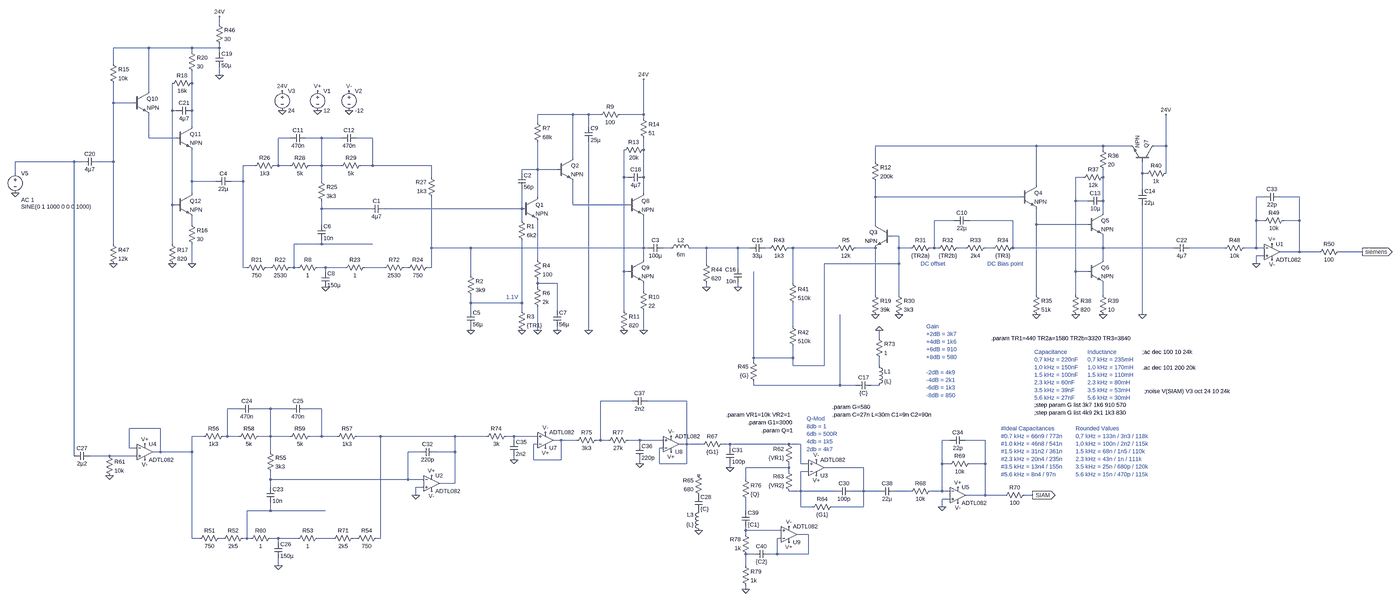
[diagram p0: schematic w295b.asc, whole sheet]
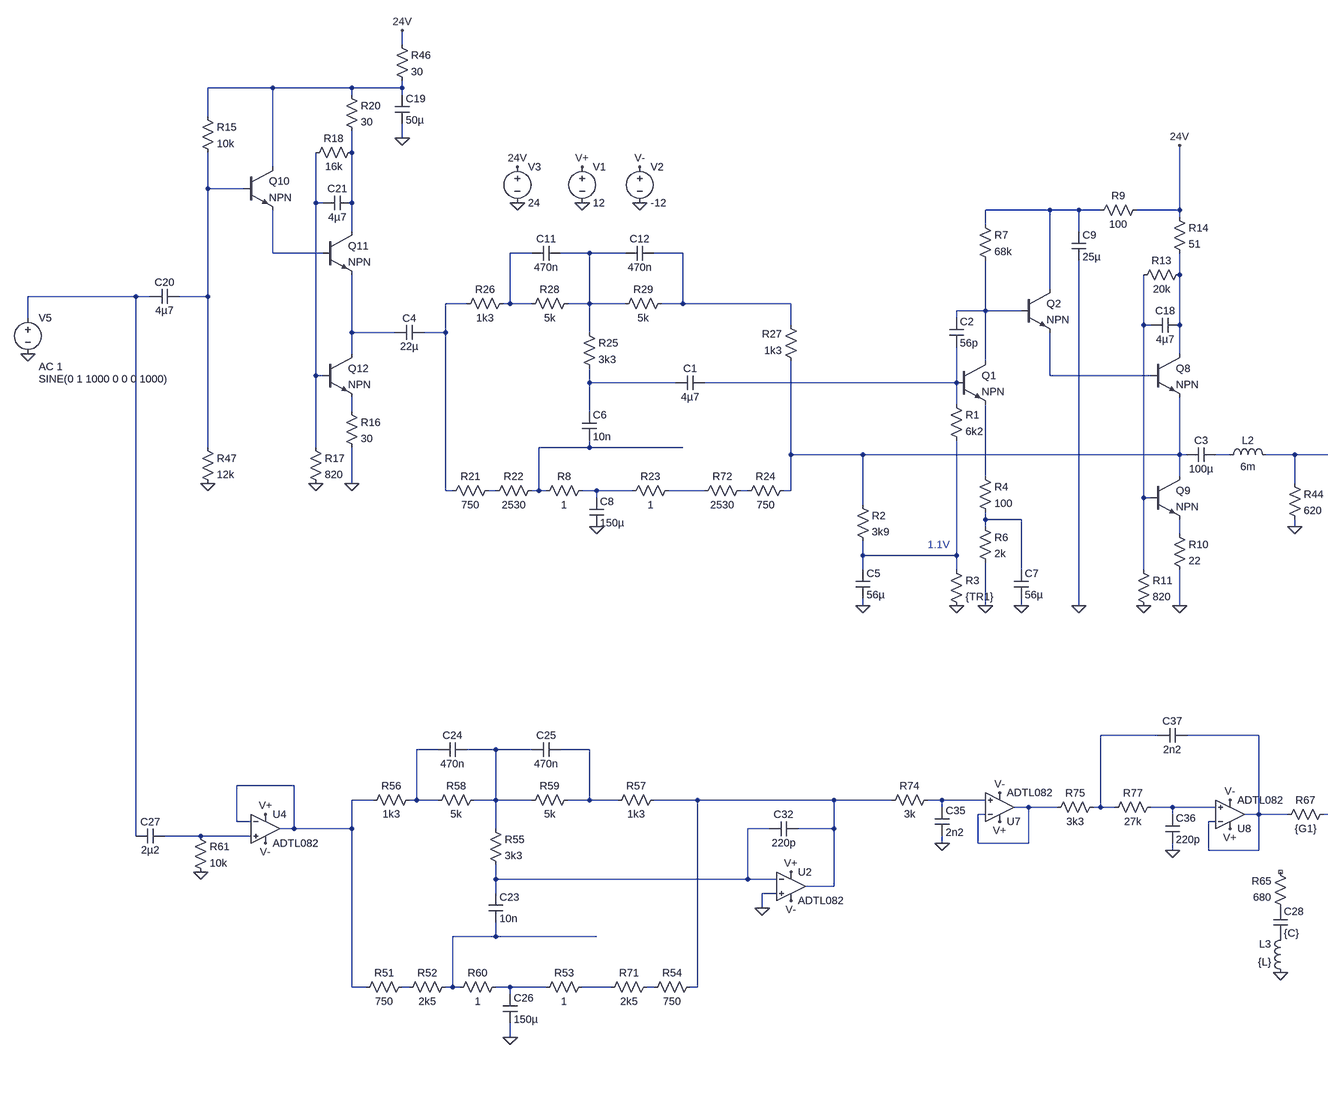
[diagram p1: schematic w295b.asc, part, row 1 of 1, column 1 of 2]
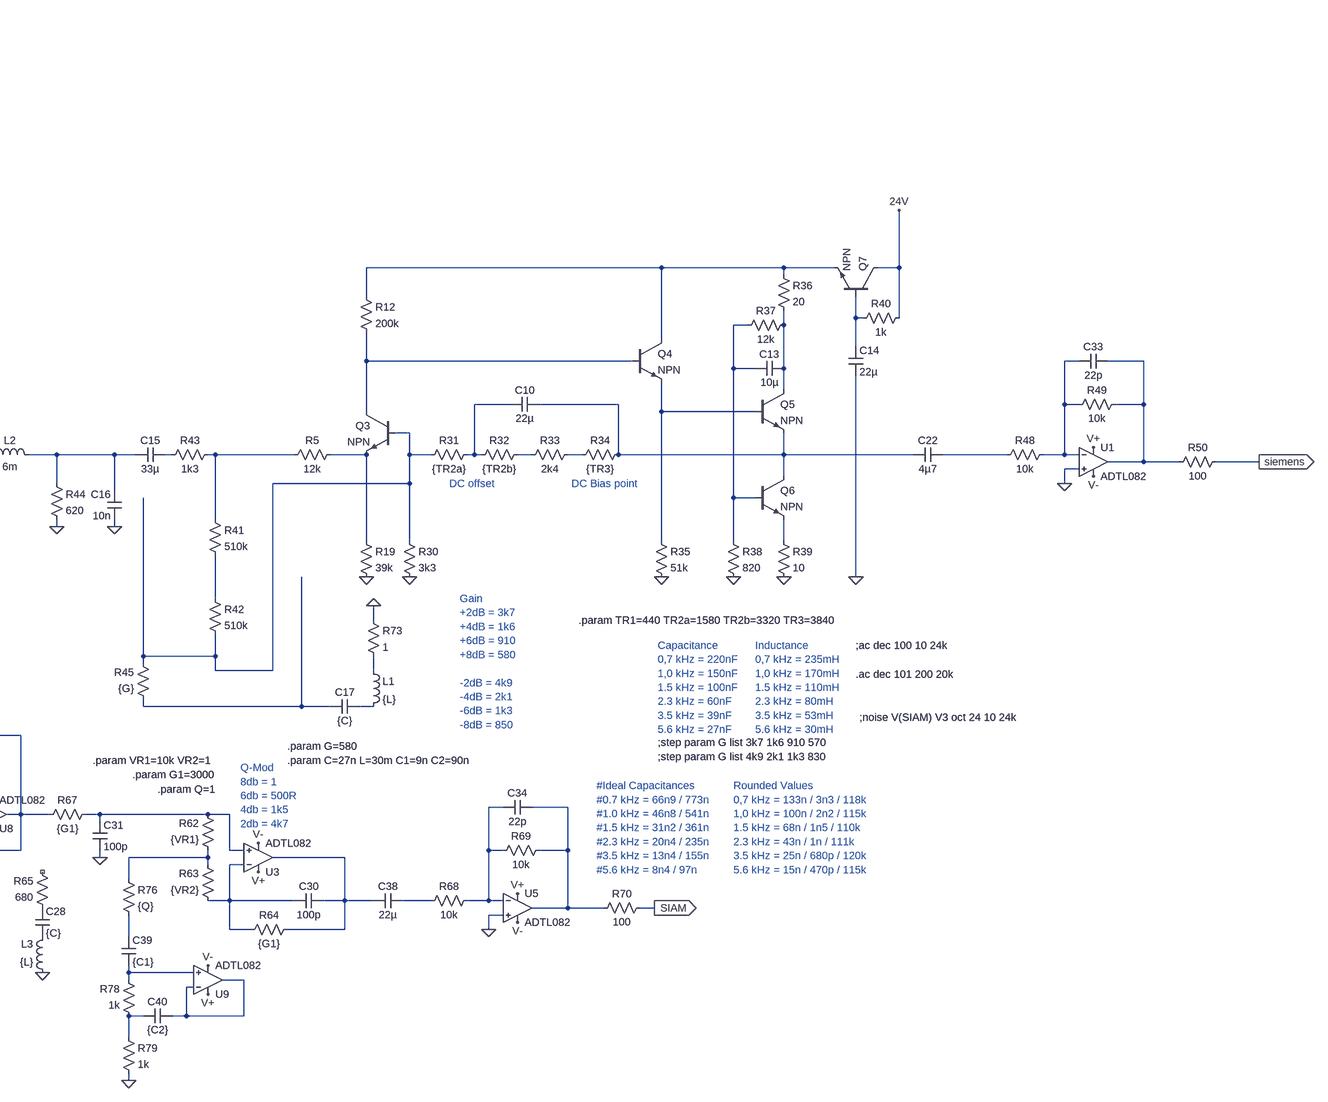
[diagram p2: schematic w295b.asc, part, row 1 of 1, column 2 of 2]
w295b.asc, the LTspice schematic file:
Version 4
SHEET 1 4260 2576
WIRE -1680 -944 -1680 -976
WIRE -1968 -848 -2112 -848
WIRE -1792 -848 -1968 -848
WIRE -1680 -848 -1680 -864
WIRE -1680 -848 -1792 -848
WIRE -1792 -832 -1792 -848
WIRE -1680 -832 -1680 -848
WIRE -2112 -784 -2112 -848
WIRE -1680 -736 -1680 -768
WIRE -1792 -704 -1792 -752
WIRE -1968 -672 -1968 -848
WIRE -2112 -624 -2112 -704
WIRE -2032 -624 -2112 -624
WIRE -1872 -592 -1872 -704
WIRE -1856 -592 -1872 -592
WIRE -1792 -592 -1792 -704
WIRE -240 -576 -384 -576
WIRE -176 -576 -240 -576
WIRE -128 -576 -176 -576
WIRE 48 -576 48 -720
WIRE 48 -576 -48 -576
WIRE 48 -560 48 -576
WIRE -384 -544 -384 -576
WIRE -1792 -528 -1792 -592
WIRE -176 -528 -176 -576
WIRE -1968 -480 -1968 -576
WIRE -1856 -480 -1968 -480
WIRE -1392 -480 -1440 -480
WIRE -1264 -480 -1328 -480
WIRE -1184 -480 -1264 -480
WIRE -1056 -480 -1120 -480
WIRE 1648 -448 992 -448
WIRE 1920 -448 1648 -448
WIRE 2032 -448 1920 -448
WIRE 2176 -448 2176 -576
WIRE 2176 -448 2128 -448
WIRE 48 -432 48 -480
WIRE 1920 -432 1920 -448
WIRE -240 -400 -240 -576
WIRE -2272 -384 -2512 -384
WIRE -2240 -384 -2272 -384
WIRE -2112 -384 -2112 -624
WIRE -2112 -384 -2176 -384
WIRE 992 -384 992 -448
WIRE -1536 -368 -1584 -368
WIRE -1440 -368 -1440 -480
WIRE -1440 -368 -1456 -368
WIRE -1392 -368 -1440 -368
WIRE -1264 -368 -1264 -480
WIRE -1264 -368 -1312 -368
WIRE -1184 -368 -1264 -368
WIRE -1056 -368 -1056 -480
WIRE -1056 -368 -1104 -368
WIRE -816 -368 -1056 -368
WIRE -384 -352 -384 -464
WIRE -384 -352 -448 -352
WIRE -304 -352 -384 -352
WIRE -2512 -336 -2512 -384
WIRE -448 -336 -448 -352
WIRE 2080 -336 2080 -384
WIRE 2096 -336 2080 -336
WIRE 2176 -336 2176 -448
WIRE -816 -320 -816 -368
WIRE -32 -320 -32 -432
WIRE -16 -320 -32 -320
WIRE 48 -320 48 -432
WIRE 1840 -320 1808 -320
WIRE 1920 -320 1920 -352
WIRE -1792 -304 -1792 -432
WIRE -1696 -304 -1792 -304
WIRE -1584 -304 -1584 -368
WIRE -1584 -304 -1632 -304
WIRE -1264 -304 -1264 -368
WIRE 1648 -288 1648 -448
WIRE 2080 -272 2080 -336
WIRE -1792 -256 -1792 -304
WIRE 48 -256 48 -320
WIRE -384 -240 -384 -352
WIRE 992 -240 992 -304
WIRE 1584 -240 992 -240
WIRE 2576 -240 2544 -240
WIRE 2720 -240 2640 -240
WIRE 1808 -224 1808 -320
WIRE 1856 -224 1808 -224
WIRE 1920 -224 1920 -320
WIRE -1872 -208 -1872 -592
WIRE -1856 -208 -1872 -208
WIRE -240 -208 -240 -304
WIRE -16 -208 -240 -208
WIRE -1264 -192 -1264 -224
WIRE -1072 -192 -1264 -192
WIRE -448 -192 -448 -272
WIRE -448 -192 -1008 -192
WIRE 1920 -176 1920 -224
WIRE -448 -144 -448 -192
WIRE 1312 -144 1232 -144
WIRE 1552 -144 1376 -144
WIRE 2544 -144 2544 -240
WIRE 2576 -144 2544 -144
WIRE 2720 -144 2720 -240
WIRE 2720 -144 2656 -144
WIRE -1792 -128 -1792 -160
WIRE -1264 -128 -1264 -192
WIRE 992 -128 992 -240
WIRE 1648 -128 1648 -192
WIRE 1856 -128 1648 -128
WIRE 1088 -80 1056 -80
WIRE -2112 -48 -2112 -384
WIRE -1872 -48 -1872 -208
WIRE -1264 -48 -1264 -64
WIRE -1264 -48 -1376 -48
WIRE -1056 -48 -1264 -48
WIRE -816 -32 -816 -240
WIRE -656 -32 -816 -32
WIRE 48 -32 48 -160
WIRE 48 -32 -656 -32
WIRE 64 -32 48 -32
WIRE 160 -32 128 -32
WIRE 304 -32 240 -32
WIRE 432 -32 304 -32
WIRE 480 -32 432 -32
WIRE 560 -32 544 -32
WIRE 656 -32 640 -32
WIRE 832 -32 656 -32
WIRE 992 -32 912 -32
WIRE 1088 -32 1088 -80
WIRE 1136 -32 1088 -32
WIRE 1232 -32 1232 -144
WIRE 1232 -32 1216 -32
WIRE 1248 -32 1232 -32
WIRE 1360 -32 1328 -32
WIRE 1472 -32 1440 -32
WIRE 1552 -32 1552 -144
WIRE 1920 -32 1920 -80
WIRE 1920 -32 1552 -32
WIRE 2208 -32 1920 -32
WIRE 2416 -32 2272 -32
WIRE 2544 -32 2544 -144
WIRE 2544 -32 2496 -32
WIRE 2576 -32 2544 -32
WIRE 2720 -16 2720 -144
WIRE 2720 -16 2640 -16
WIRE 2800 -16 2720 -16
WIRE 2976 -16 2880 -16
WIRE 2576 0 2544 0
WIRE -384 16 -384 -144
WIRE 48 16 48 -32
WIRE 1920 16 1920 -32
WIRE -1792 32 -1792 -48
WIRE 304 32 304 -32
WIRE 1088 32 1088 -32
WIRE 1088 32 784 32
WIRE 2544 32 2544 0
WIRE -1584 48 -1584 -304
WIRE -1568 48 -1584 48
WIRE -1472 48 -1488 48
WIRE -1376 48 -1376 -48
WIRE -1376 48 -1392 48
WIRE -1360 48 -1376 48
WIRE -1248 48 -1280 48
WIRE -1168 48 -1248 48
WIRE -1008 48 -1088 48
WIRE -912 48 -928 48
WIRE -816 48 -816 -32
WIRE -816 48 -832 48
WIRE 432 48 432 -32
WIRE -1248 64 -1248 48
WIRE -32 64 -32 -320
WIRE -16 64 -32 64
WIRE 1808 64 1808 -224
WIRE 1856 64 1808 64
WIRE -656 80 -656 -32
WIRE -384 112 -384 96
WIRE -304 112 -384 112
WIRE 656 112 656 -32
WIRE -384 128 -384 112
WIRE 304 128 304 112
WIRE 432 128 432 112
WIRE 48 144 48 112
WIRE 992 160 992 -32
WIRE 1088 160 1088 32
WIRE 1648 160 1648 -128
WIRE 1808 160 1808 64
WIRE 1920 160 1920 112
WIRE -656 192 -656 160
WIRE -448 192 -448 -64
WIRE -448 192 -656 192
WIRE -656 224 -656 192
WIRE -448 224 -448 192
WIRE -304 224 -304 112
WIRE -32 224 -32 64
WIRE 2080 240 2080 -208
WIRE 656 288 656 192
WIRE -656 304 -656 288
WIRE -384 304 -384 208
WIRE -304 304 -304 288
WIRE -176 304 -176 -464
WIRE 48 304 48 224
WIRE 1008 336 1008 304
WIRE 496 416 496 64
WIRE 656 416 656 368
WIRE 656 416 496 416
WIRE 496 432 496 416
WIRE 656 448 656 416
WIRE 784 448 784 32
WIRE 784 448 656 448
WIRE 1008 448 1008 416
WIRE 496 528 496 512
WIRE 848 528 848 240
WIRE 848 528 496 528
WIRE 912 528 848 528
WIRE 1008 528 976 528
WIRE 0 592 -128 592
WIRE 224 592 64 592
WIRE -1600 624 -1648 624
WIRE -1472 624 -1536 624
WIRE -1392 624 -1472 624
WIRE -1264 624 -1328 624
WIRE -1920 704 -2048 704
WIRE -1744 736 -1792 736
WIRE -1648 736 -1648 624
WIRE -1648 736 -1664 736
WIRE -1600 736 -1648 736
WIRE -1472 736 -1472 624
WIRE -1472 736 -1520 736
WIRE -1392 736 -1472 736
WIRE -1264 736 -1264 624
WIRE -1264 736 -1312 736
WIRE -1200 736 -1264 736
WIRE -1024 736 -1120 736
WIRE -720 736 -1024 736
WIRE -592 736 -720 736
WIRE -480 736 -512 736
WIRE -384 736 -480 736
WIRE -480 752 -480 736
WIRE -288 752 -320 752
WIRE -224 752 -288 752
WIRE -128 752 -128 592
WIRE -128 752 -144 752
WIRE -96 752 -128 752
WIRE 32 752 -16 752
WIRE 128 752 32 752
WIRE 1296 752 1264 752
WIRE 1440 752 1360 752
WIRE -384 768 -400 768
WIRE 32 768 32 752
WIRE 224 768 224 592
WIRE 224 768 192 768
WIRE 288 768 224 768
WIRE 400 768 368 768
WIRE 640 768 400 768
WIRE 688 768 640 768
WIRE -2048 784 -2048 704
WIRE -2016 784 -2048 784
WIRE 128 784 112 784
WIRE 400 784 400 768
WIRE -1920 800 -1920 704
WIRE -1920 800 -1952 800
WIRE -1792 800 -1792 736
WIRE -1792 800 -1920 800
WIRE -1472 800 -1472 736
WIRE -864 800 -912 800
WIRE -720 800 -720 736
WIRE -720 800 -800 800
WIRE -2272 816 -2272 -384
WIRE -2128 816 -2208 816
WIRE -2016 816 -2128 816
WIRE -480 832 -480 816
WIRE -400 832 -400 768
WIRE -288 832 -288 752
WIRE -288 832 -400 832
WIRE 32 848 32 832
WIRE 112 848 112 784
WIRE 224 848 224 768
WIRE 224 848 112 848
WIRE 688 848 688 768
WIRE 720 848 688 848
WIRE 1264 848 1264 752
WIRE 1296 848 1264 848
WIRE 1440 848 1440 752
WIRE 1440 848 1376 848
WIRE 400 864 400 848
WIRE 640 864 640 848
WIRE 640 864 464 864
WIRE 944 864 784 864
WIRE 640 880 640 864
WIRE 720 880 688 880
WIRE -1472 912 -1472 880
WIRE -912 912 -912 800
WIRE -912 912 -1472 912
WIRE -848 912 -912 912
WIRE 464 912 464 864
WIRE -720 928 -720 800
WIRE -720 928 -784 928
WIRE -1472 944 -1472 912
WIRE -848 944 -880 944
WIRE 688 960 688 880
WIRE 688 960 640 960
WIRE 832 960 688 960
WIRE 944 960 944 864
WIRE 944 960 896 960
WIRE 1008 960 944 960
WIRE 1136 960 1072 960
WIRE 1264 960 1264 848
WIRE 1264 960 1216 960
WIRE 1296 960 1264 960
WIRE -880 976 -880 944
WIRE 1440 976 1440 848
WIRE 1440 976 1360 976
WIRE 1520 976 1440 976
WIRE 1632 976 1600 976
WIRE 1296 992 1264 992
WIRE 688 1024 688 960
WIRE 736 1024 688 1024
WIRE 944 1024 944 960
WIRE 944 1024 816 1024
WIRE 1264 1024 1264 992
WIRE -1472 1040 -1472 1008
WIRE -1472 1040 -1568 1040
WIRE -1248 1040 -1472 1040
WIRE 464 1040 464 992
WIRE 464 1120 464 1104
WIRE 608 1120 464 1120
WIRE 464 1136 464 1120
WIRE 720 1136 672 1136
WIRE -1792 1152 -1792 800
WIRE -1760 1152 -1792 1152
WIRE -1664 1152 -1680 1152
WIRE -1568 1152 -1568 1040
WIRE -1568 1152 -1584 1152
WIRE -1552 1152 -1568 1152
WIRE -1440 1152 -1472 1152
WIRE -1360 1152 -1440 1152
WIRE -1216 1152 -1280 1152
WIRE -1120 1152 -1136 1152
WIRE -1024 1152 -1024 736
WIRE -1024 1152 -1040 1152
WIRE 608 1152 592 1152
WIRE -1440 1168 -1440 1152
WIRE 496 1216 464 1216
WIRE 592 1216 592 1152
WIRE 592 1216 560 1216
WIRE 720 1216 720 1136
WIRE 720 1216 592 1216
WIRE -1440 1264 -1440 1232
WIRE 464 1264 464 1216
WIRE 464 1360 464 1344
FLAG -1280 -592 0
FLAG -1280 -672 V+
FLAG -1152 -592 0
FLAG -1152 -672 V-
FLAG -2512 -256 0
FLAG -1248 128 0
FLAG -1424 -592 0
FLAG -1424 -672 24V
FLAG 992 240 0
FLAG 1088 240 0
FLAG 1648 240 0
FLAG 2976 -16 siemens
IOPIN 2976 -16 Out
FLAG 1808 240 0
FLAG 1920 240 0
FLAG 2176 -576 24V
FLAG 2080 240 0
FLAG 304 128 0
FLAG 432 128 0
FLAG 1008 304 0
FLAG -448 304 0
FLAG -656 304 0
FLAG -384 304 0
FLAG -304 304 0
FLAG -176 304 0
FLAG -32 304 0
FLAG 48 304 0
FLAG 48 -720 24V
FLAG -1872 32 0
FLAG -1792 32 0
FLAG -1680 -976 24V
FLAG -1680 -736 0
FLAG -2112 32 0
FLAG 2544 32 0
FLAG 2608 -48 V+
FLAG 2608 16 V-
FLAG -1440 1264 0
FLAG -816 896 V+
FLAG -816 960 V-
FLAG -880 976 0
FLAG 1632 976 SIAM
IOPIN 1632 976 Out
FLAG -1984 768 V+
FLAG -1984 832 V-
FLAG -2128 896 0
FLAG 752 896 V+
FLAG 752 832 V-
FLAG 400 864 0
FLAG 1264 1024 0
FLAG 1328 944 V+
FLAG 1328 1008 V-
FLAG -352 784 V+
FLAG -352 720 V-
FLAG 160 800 V+
FLAG 160 736 V-
FLAG -480 832 0
FLAG 32 848 0
FLAG 640 1168 V+
FLAG 640 1104 V-
FLAG 464 1360 0
FLAG 272 1120 0
SYMBOL voltage -1280 -688 R0
WINDOW 123 0 0 Left 0
WINDOW 39 0 0 Left 0
SYMATTR InstName V1
SYMATTR Value 12
SYMBOL voltage -1152 -688 R0
WINDOW 123 0 0 Left 0
WINDOW 39 0 0 Left 0
SYMATTR InstName V2
SYMATTR Value -12
SYMBOL res -1472 32 R90
WINDOW 0 0 56 VBottom 2
WINDOW 3 32 56 VTop 2
SYMATTR InstName R21
SYMATTR Value 750
SYMBOL res -1376 32 R90
WINDOW 0 0 56 VBottom 2
WINDOW 3 32 56 VTop 2
SYMATTR InstName R22
SYMATTR Value 2530
SYMBOL res -1072 32 R90
WINDOW 0 0 56 VBottom 2
WINDOW 3 32 56 VTop 2
SYMATTR InstName R23
SYMATTR Value 1
SYMBOL res -816 32 R90
WINDOW 0 0 56 VBottom 2
WINDOW 3 32 56 VTop 2
SYMATTR InstName R24
SYMATTR Value 750
SYMBOL cap -1280 -128 R0
SYMATTR InstName C6
SYMATTR Value 10n
SYMBOL res -1280 -320 R0
SYMATTR InstName R25
SYMATTR Value 3k3
SYMBOL res -1440 -384 R90
WINDOW 0 0 56 VBottom 2
WINDOW 3 32 56 VTop 2
SYMATTR InstName R26
SYMATTR Value 1k3
SYMBOL res -800 -224 R180
WINDOW 0 36 76 Left 2
WINDOW 3 36 40 Left 2
SYMATTR InstName R27
SYMATTR Value 1k3
SYMBOL cap -1328 -496 R90
WINDOW 0 0 32 VBottom 2
WINDOW 3 32 32 VTop 2
SYMATTR InstName C11
SYMATTR Value 470n
SYMBOL cap -1120 -496 R90
WINDOW 0 0 32 VBottom 2
WINDOW 3 32 32 VTop 2
SYMATTR InstName C12
SYMATTR Value 470n
SYMBOL res -1296 -384 R90
WINDOW 0 0 56 VBottom 2
WINDOW 3 32 56 VTop 2
SYMATTR InstName R28
SYMATTR Value 5k
SYMBOL res -1088 -384 R90
WINDOW 0 0 56 VBottom 2
WINDOW 3 32 56 VTop 2
SYMATTR InstName R29
SYMATTR Value 5k
SYMBOL voltage -2512 -352 R0
WINDOW 3 24 152 Left 2
WINDOW 123 24 124 Left 2
WINDOW 39 0 0 Left 0
SYMATTR Value SINE(0 1 1000 0 0 0 1000)
SYMATTR Value2 AC 1
SYMATTR InstName V5
SYMBOL res -1264 32 R90
WINDOW 0 0 56 VBottom 2
WINDOW 3 32 56 VTop 2
SYMATTR InstName R8
SYMATTR Value 1
SYMBOL cap -1264 64 R0
SYMATTR InstName C8
SYMATTR Value 150µ
SYMBOL cap -1696 -320 M90
WINDOW 0 0 32 VBottom 2
WINDOW 3 32 32 VTop 2
SYMATTR InstName C4
SYMATTR Value 22µ
SYMBOL voltage -1424 -688 R0
WINDOW 123 0 0 Left 0
WINDOW 39 0 0 Left 0
SYMATTR InstName V3
SYMATTR Value 24
SYMBOL npn 1056 -128 M0
SYMATTR InstName Q3
SYMBOL npn 2128 -384 M270
SYMATTR InstName Q7
SYMBOL res 928 -48 R90
WINDOW 0 0 56 VBottom 2
WINDOW 3 32 56 VTop 2
SYMATTR InstName R5
SYMATTR Value 12k
SYMBOL res 976 -400 R0
SYMATTR InstName R12
SYMATTR Value 200k
SYMBOL res 976 144 R0
SYMATTR InstName R19
SYMATTR Value 39k
SYMBOL res 1072 144 R0
SYMATTR InstName R30
SYMATTR Value 3k3
SYMBOL res 1232 -48 R90
WINDOW 0 0 56 VBottom 2
WINDOW 3 32 56 VTop 2
SYMATTR InstName R31
SYMATTR Value {TR2a}
SYMBOL res 1344 -48 R90
WINDOW 0 0 56 VBottom 2
WINDOW 3 32 56 VTop 2
SYMATTR InstName R32
SYMATTR Value {TR2b}
SYMBOL res 1456 -48 R90
WINDOW 0 0 56 VBottom 2
WINDOW 3 32 56 VTop 2
SYMATTR InstName R33
SYMATTR Value 2k4
SYMBOL res 1568 -48 R90
WINDOW 0 0 56 VBottom 2
WINDOW 3 32 56 VTop 2
SYMATTR InstName R34
SYMATTR Value {TR3}
SYMBOL cap 1376 -160 R90
WINDOW 0 0 32 VBottom 2
WINDOW 3 32 32 VTop 2
SYMATTR InstName C10
SYMATTR Value 22µ
SYMBOL npn 1584 -288 R0
SYMATTR InstName Q4
SYMBOL npn 1856 -176 R0
SYMATTR InstName Q5
SYMBOL npn 1856 16 R0
SYMATTR InstName Q6
SYMBOL res 1632 144 R0
SYMATTR InstName R35
SYMATTR Value 51k
SYMBOL res 1904 -448 R0
SYMATTR InstName R36
SYMATTR Value 20
SYMBOL res 1936 -336 R90
WINDOW 0 0 56 VBottom 2
WINDOW 3 32 56 VTop 2
SYMATTR InstName R37
SYMATTR Value 12k
SYMBOL cap 1920 -240 R90
WINDOW 0 0 32 VBottom 2
WINDOW 3 32 32 VTop 2
SYMATTR InstName C13
SYMATTR Value 10µ
SYMBOL res 1792 144 R0
SYMATTR InstName R38
SYMATTR Value 820
SYMBOL res 1904 144 R0
SYMATTR InstName R39
SYMATTR Value 10
SYMBOL res 2192 -352 R90
WINDOW 0 0 56 VBottom 2
WINDOW 3 32 56 VTop 2
SYMATTR InstName R40
SYMATTR Value 1k
SYMBOL cap 2064 -272 R0
SYMATTR InstName C14
SYMATTR Value 22µ
SYMBOL res 640 96 R0
SYMATTR InstName R41
SYMATTR Value 510k
SYMBOL res 640 272 R0
SYMATTR InstName R42
SYMATTR Value 510k
SYMBOL res 656 -48 R90
WINDOW 0 0 56 VBottom 2
WINDOW 3 32 56 VTop 2
SYMATTR InstName R43
SYMATTR Value 1k3
SYMBOL cap 544 -48 R90
WINDOW 0 0 32 VBottom 2
WINDOW 3 32 32 VTop 2
SYMATTR InstName C15
SYMATTR Value 33µ
SYMBOL cap 448 112 R180
WINDOW 0 24 56 Left 2
WINDOW 3 24 8 Left 2
SYMATTR InstName C16
SYMATTR Value 10n
SYMBOL res 288 16 R0
SYMATTR InstName R44
SYMATTR Value 620
SYMBOL res 512 528 R180
WINDOW 0 36 76 Left 2
WINDOW 3 36 40 Left 2
SYMATTR InstName R45
SYMATTR Value {G}
SYMBOL cap 976 512 R90
WINDOW 0 0 32 VBottom 2
WINDOW 3 32 32 VTop 2
SYMATTR InstName C17
SYMATTR Value {C}
SYMBOL ind 992 432 R0
SYMATTR InstName L1
SYMATTR Value {L}
SYMBOL cap 128 -48 R90
WINDOW 0 0 32 VBottom 2
WINDOW 3 32 32 VTop 2
SYMATTR InstName C3
SYMATTR Value 100µ
SYMBOL cap -1008 -208 R90
WINDOW 0 0 32 VBottom 2
WINDOW 3 32 32 VTop 2
SYMATTR InstName C1
SYMATTR Value 4µ7
SYMBOL npn -448 -240 R0
SYMATTR InstName Q1
SYMBOL npn -304 -400 R0
SYMATTR InstName Q2
SYMBOL npn -16 -256 R0
SYMATTR InstName Q8
SYMBOL npn -16 16 R0
SYMATTR InstName Q9
SYMBOL res -464 -160 R0
SYMATTR InstName R1
SYMATTR Value 6k2
SYMBOL cap -464 -336 R0
SYMATTR InstName C2
SYMATTR Value 56p
SYMBOL res -672 64 R0
SYMATTR InstName R2
SYMATTR Value 3k9
SYMBOL cap -672 224 R0
SYMATTR InstName C5
SYMATTR Value 56µ
SYMBOL res -464 208 R0
SYMATTR InstName R3
SYMATTR Value {TR1}
SYMBOL res -400 0 R0
SYMATTR InstName R4
SYMATTR Value 100
SYMBOL res -400 112 R0
SYMATTR InstName R6
SYMATTR Value 2k
SYMBOL cap -320 224 R0
SYMATTR InstName C7
SYMATTR Value 56µ
SYMBOL res -400 -560 R0
SYMATTR InstName R7
SYMATTR Value 68k
SYMBOL cap -192 -528 R0
SYMATTR InstName C9
SYMATTR Value 25µ
SYMBOL res -32 -592 R90
WINDOW 0 0 56 VBottom 2
WINDOW 3 32 56 VTop 2
SYMATTR InstName R9
SYMATTR Value 100
SYMBOL res 32 128 R0
SYMATTR InstName R10
SYMATTR Value 22
SYMBOL res -48 208 R0
SYMATTR InstName R11
SYMATTR Value 820
SYMBOL cap 48 -336 R90
WINDOW 0 0 32 VBottom 2
WINDOW 3 32 32 VTop 2
SYMATTR InstName C18
SYMATTR Value 4µ7
SYMBOL res 64 -448 R90
WINDOW 0 0 56 VBottom 2
WINDOW 3 32 56 VTop 2
SYMATTR InstName R13
SYMATTR Value 20k
SYMBOL res 32 -576 R0
SYMATTR InstName R14
SYMATTR Value 51
SYMBOL npn -2032 -672 R0
SYMATTR InstName Q10
SYMBOL npn -1856 -528 R0
SYMATTR InstName Q11
SYMBOL npn -1856 -256 R0
SYMATTR InstName Q12
SYMBOL res -1808 -144 R0
SYMATTR InstName R16
SYMATTR Value 30
SYMBOL res -1888 -64 R0
SYMATTR InstName R17
SYMATTR Value 820
SYMBOL cap -1792 -608 R90
WINDOW 0 0 32 VBottom 2
WINDOW 3 32 32 VTop 2
SYMATTR InstName C21
SYMATTR Value 4µ7
SYMBOL res -1776 -720 R90
WINDOW 0 0 56 VBottom 2
WINDOW 3 32 56 VTop 2
SYMATTR InstName R18
SYMATTR Value 16k
SYMBOL res -1808 -848 R0
SYMATTR InstName R20
SYMATTR Value 30
SYMBOL cap -1696 -832 R0
SYMATTR InstName C19
SYMATTR Value 50µ
SYMBOL res -1696 -960 R0
SYMATTR InstName R46
SYMATTR Value 30
SYMBOL res -2128 -800 R0
SYMATTR InstName R15
SYMATTR Value 10k
SYMBOL res -2128 -64 R0
SYMATTR InstName R47
SYMATTR Value 12k
SYMBOL cap -2176 -400 R90
WINDOW 0 0 32 VBottom 2
WINDOW 3 32 32 VTop 2
SYMATTR InstName C20
SYMATTR Value 4µ7
SYMBOL cap 2272 -48 R90
WINDOW 0 0 32 VBottom 2
WINDOW 3 32 32 VTop 2
SYMATTR InstName C22
SYMATTR Value 4µ7
SYMBOL OpAmps\\ADTL082 2608 -80 R0
SYMATTR InstName U1
SYMBOL res 2512 -48 R90
WINDOW 0 0 56 VBottom 2
WINDOW 3 32 56 VTop 2
SYMATTR InstName R48
SYMATTR Value 10k
SYMBOL res 2672 -160 R90
WINDOW 0 0 56 VBottom 2
WINDOW 3 32 56 VTop 2
SYMATTR InstName R49
SYMATTR Value 10k
SYMBOL res 2896 -32 R90
WINDOW 0 0 56 VBottom 2
WINDOW 3 32 56 VTop 2
SYMATTR InstName R50
SYMATTR Value 100
SYMBOL res -1664 1136 R90
WINDOW 0 0 56 VBottom 2
WINDOW 3 32 56 VTop 2
SYMATTR InstName R51
SYMATTR Value 750
SYMBOL res -1568 1136 R90
WINDOW 0 0 56 VBottom 2
WINDOW 3 32 56 VTop 2
SYMATTR InstName R52
SYMATTR Value 2k5
SYMBOL res -1264 1136 R90
WINDOW 0 0 56 VBottom 2
WINDOW 3 32 56 VTop 2
SYMATTR InstName R53
SYMATTR Value 1
SYMBOL res -1024 1136 R90
WINDOW 0 0 56 VBottom 2
WINDOW 3 32 56 VTop 2
SYMATTR InstName R54
SYMATTR Value 750
SYMBOL cap -1488 944 R0
SYMATTR InstName C23
SYMATTR Value 10n
SYMBOL res -1488 784 R0
SYMATTR InstName R55
SYMATTR Value 3k3
SYMBOL res -1648 720 R90
WINDOW 0 0 56 VBottom 2
WINDOW 3 32 56 VTop 2
SYMATTR InstName R56
SYMATTR Value 1k3
SYMBOL res -1216 752 R270
WINDOW 0 32 56 VTop 2
WINDOW 3 0 56 VBottom 2
SYMATTR InstName R57
SYMATTR Value 1k3
SYMBOL cap -1536 608 R90
WINDOW 0 0 32 VBottom 2
WINDOW 3 32 32 VTop 2
SYMATTR InstName C24
SYMATTR Value 470n
SYMBOL cap -1328 608 R90
WINDOW 0 0 32 VBottom 2
WINDOW 3 32 32 VTop 2
SYMATTR InstName C25
SYMATTR Value 470n
SYMBOL res -1504 720 R90
WINDOW 0 0 56 VBottom 2
WINDOW 3 32 56 VTop 2
SYMATTR InstName R58
SYMATTR Value 5k
SYMBOL res -1296 720 R90
WINDOW 0 0 56 VBottom 2
WINDOW 3 32 56 VTop 2
SYMATTR InstName R59
SYMATTR Value 5k
SYMBOL res -1456 1136 R90
WINDOW 0 0 56 VBottom 2
WINDOW 3 32 56 VTop 2
SYMATTR InstName R60
SYMATTR Value 1
SYMBOL cap -1456 1168 R0
SYMATTR InstName C26
SYMATTR Value 150µ
SYMBOL OpAmps\\ADTL082 -816 864 R0
SYMATTR InstName U2
SYMBOL OpAmps\\ADTL082 -1984 736 R0
SYMATTR InstName U4
SYMBOL cap -2208 800 R90
WINDOW 0 0 32 VBottom 2
WINDOW 3 32 32 VTop 2
SYMATTR InstName C27
SYMATTR Value 2µ2
SYMBOL res -2144 800 R0
SYMATTR InstName R61
SYMATTR Value 10k
SYMBOL res 656 864 R180
WINDOW 0 36 76 Left 2
WINDOW 3 36 40 Left 2
SYMATTR InstName R62
SYMATTR Value {VR1}
SYMATTR SpiceLine tol=1 pwr=0.25
SYMBOL res 656 976 R180
WINDOW 0 36 76 Left 2
WINDOW 3 36 40 Left 2
SYMATTR InstName R63
SYMATTR Value {VR2}
SYMATTR SpiceLine tol=1 pwr=0.25
SYMBOL res 832 1008 R90
WINDOW 0 0 56 VBottom 2
WINDOW 3 32 56 VTop 2
SYMATTR InstName R64
SYMATTR Value {G1}
SYMBOL cap 896 944 R90
WINDOW 0 0 32 VBottom 2
WINDOW 3 32 32 VTop 2
SYMATTR InstName C30
SYMATTR Value 100p
SYMBOL cap 384 784 R0
SYMATTR InstName C31
SYMATTR Value 100p
SYMBOL res 384 752 R90
WINDOW 0 0 56 VBottom 2
WINDOW 3 32 56 VTop 2
SYMATTR InstName R67
SYMATTR Value {G1}
SYMBOL OpAmps\\ADTL082 752 928 M180
SYMATTR InstName U3
SYMBOL cap -800 784 R90
WINDOW 0 0 32 VBottom 2
WINDOW 3 32 32 VTop 2
SYMATTR InstName C32
SYMATTR Value 220p
SYMBOL cap 2640 -256 R90
WINDOW 0 0 32 VBottom 2
WINDOW 3 32 32 VTop 2
SYMATTR InstName C33
SYMATTR Value 22p
SYMBOL OpAmps\\ADTL082 1328 912 R0
SYMATTR InstName U5
SYMBOL res 1232 944 R90
WINDOW 0 0 56 VBottom 2
WINDOW 3 32 56 VTop 2
SYMATTR InstName R68
SYMATTR Value 10k
SYMBOL res 1392 832 R90
WINDOW 0 0 56 VBottom 2
WINDOW 3 32 56 VTop 2
SYMATTR InstName R69
SYMATTR Value 10k
SYMBOL res 1616 960 R90
WINDOW 0 0 56 VBottom 2
WINDOW 3 32 56 VTop 2
SYMATTR InstName R70
SYMATTR Value 100
SYMBOL res -1120 1136 R90
WINDOW 0 0 56 VBottom 2
WINDOW 3 32 56 VTop 2
SYMATTR InstName R71
SYMATTR Value 2k5
SYMBOL res -912 32 R90
WINDOW 0 0 56 VBottom 2
WINDOW 3 32 56 VTop 2
SYMATTR InstName R72
SYMATTR Value 2530
SYMBOL res 992 320 R0
SYMATTR InstName R73
SYMATTR Value 1
SYMBOL res 448 896 R0
SYMATTR InstName R76
SYMATTR Value {Q}
SYMBOL ind 144 -16 R270
WINDOW 0 32 56 VTop 2
WINDOW 3 5 56 VBottom 2
SYMATTR InstName L2
SYMATTR Value 6m
SYMBOL OpAmps\\ADTL082 -352 816 M180
SYMATTR InstName U7
SYMBOL OpAmps\\ADTL082 160 832 M180
SYMATTR InstName U8
SYMBOL res -496 720 R90
WINDOW 0 0 56 VBottom 2
WINDOW 3 32 56 VTop 2
SYMATTR InstName R74
SYMATTR Value 3k
SYMBOL cap -496 752 R0
SYMATTR InstName C35
SYMATTR Value 2n2
SYMBOL res -128 736 R90
WINDOW 0 0 56 VBottom 2
WINDOW 3 32 56 VTop 2
SYMATTR InstName R75
SYMATTR Value 3k3
SYMBOL res 0 736 R90
WINDOW 0 0 56 VBottom 2
WINDOW 3 32 56 VTop 2
SYMATTR InstName R77
SYMATTR Value 27k
SYMBOL cap 16 768 R0
SYMATTR InstName C36
SYMATTR Value 220p
SYMBOL cap 64 576 R90
WINDOW 0 0 32 VBottom 2
WINDOW 3 32 32 VTop 2
SYMATTR InstName C37
SYMATTR Value 2n2
SYMBOL cap 1360 736 R90
WINDOW 0 0 32 VBottom 2
WINDOW 3 32 32 VTop 2
SYMATTR InstName C34
SYMATTR Value 22p
SYMBOL cap 1072 944 R90
WINDOW 0 0 32 VBottom 2
WINDOW 3 32 32 VTop 2
SYMATTR InstName C38
SYMATTR Value 22µ
SYMBOL Opamps\\ADTL082 640 1200 M180
SYMATTR InstName U9
SYMBOL cap 448 1040 R0
SYMATTR InstName C39
SYMATTR Value {C1}
SYMBOL res 480 1232 R180
WINDOW 0 36 76 Left 2
WINDOW 3 36 40 Left 2
SYMATTR InstName R78
SYMATTR Value 1k
SYMBOL cap 560 1200 R90
WINDOW 0 0 32 VBottom 2
WINDOW 3 32 32 VTop 2
SYMATTR InstName C40
SYMATTR Value {C2}
SYMBOL res 448 1248 R0
SYMATTR InstName R79
SYMATTR Value 1k
SYMBOL res 288 992 R180
WINDOW 0 36 76 Left 2
WINDOW 3 36 40 Left 2
SYMATTR InstName R65
SYMATTR Value 680
SYMBOL cap 256 976 R0
SYMATTR InstName C28
SYMATTR Value {C}
SYMBOL ind 288 1136 R180
WINDOW 0 36 80 Left 2
WINDOW 3 36 40 Left 2
SYMATTR InstName L3
SYMATTR Value {L}
TEXT 2080 392 Left 2 !;ac dec 100 10 24k
TEXT 1856 392 Left 2 ;Inductance\n0,7 kHz = 235mH\n1,0 kHz = 170mH\n1.5 kHz = 110mH\n2.3 kHz = 80mH\n3.5 kHz = 53mH\n5.6 kHz = 30mH
TEXT 1464 336 Left 2 !.param TR1=440 TR2a=1580 TR2b=3320 TR3=3840
TEXT 1640 392 Left 2 ;Capacitance\n0,7 kHz = 220nF\n1,0 kHz = 150nF\n1.5 kHz = 100nF\n2.3 kHz = 60nF\n3.5 kHz = 39nF\n5.6 kHz = 27nF
TEXT 1200 288 Left 2 ;Gain\n+2dB = 3k7\n+4dB = 1k6\n+6dB = 910\n+8dB = 580\n \n-2dB = 4k9\n-4dB = 2k1\n-6dB = 1k3\n-8dB = 850
TEXT 1640 608 Left 2 !;step param G list 3k7 1k6 910 570
TEXT 1640 640 Left 2 !;step param G list 4k9 2k1 1k3 830
TEXT -512 168 Left 2 ;1.1V
TEXT 1176 32 Left 2 ;DC offset
TEXT 1448 32 Left 2 ;DC Bias point
TEXT 712 664 Left 2 ;Q-Mod\n8db = 1\n6db = 500R\n4db = 1k5\n2db = 4k7
TEXT 1504 704 Left 2 ;#Ideal Capacitances\n#0.7 kHz = 66n9 / 773n\n#1.0 kHz = 46n8 / 541n\n#1.5 kHz = 31n2 / 361n\n#2.3 kHz = 20n4 / 235n\n#3.5 kHz = 13n4 / 155n\n#5.6 kHz = 8n4 / 97n
TEXT 816 616 Left 2 !.param G=580
TEXT 816 648 Left 2 !.param C=27n L=30m C1=9n C2=90n
TEXT 1808 704 Left 2 ;Rounded Values\n0,7 kHz = 133n / 3n3 / 118k\n1,0 kHz = 100n / 2n2 / 115k\n1.5 kHz = 68n / 1n5 / 110k\n2.3 kHz = 43n / 1n / 111k\n3.5 kHz = 25n / 680p / 120k\n5.6 kHz = 15n / 470p / 115k
TEXT 384 648 Left 2 !.param VR1=10k VR2=1
TEXT 528 712 Left 2 !.param Q=1
TEXT 2080 456 Left 2 !.ac dec 101 200 20k
TEXT 2088 552 Left 2 !;noise V(SIAM) V3 oct 24 10 24k
TEXT 472 680 Left 2 !.param G1=3000

The netlist it stands for:
* w295b.asc
V1 V+ 0 12
V2 V- 0 -12
R21 N042 N013 750
R22 N031 N042 2530
R23 N044 N043 1
R24 N032 N045 750
C6 N024 N031 10n
R25 N008 N024 3k3
R26 N007 N013 1k3
R27 N032 N009 1k3
C11 N008 N007 470n
C12 N009 N008 470n
R28 N008 N007 5k
R29 N009 N008 5k
V5 N012 0 SINE(0 1 1000 0 0 0 1000) AC 1
R8 N043 N031 1
C8 N043 0 150µ
C4 N019 N013 22µ
V3 24V 0 24
Q3 N020 N030 N037 0 NPN
Q7 24V N015 N010 0 NPN
R5 N037 N036 12k
R12 N010 N020 200k
R19 N037 0 39k
R30 N030 0 3k3
R31 N026 N030 {TR2a}
R32 N038 N026 {TR2b}
R33 N039 N038 2k4
R34 N027 N039 {TR3}
C10 N027 N026 22µ
Q4 N010 N020 N029 0 NPN
Q5 N018 N029 N027 0 NPN
Q6 N027 N017 N048 0 NPN
R35 N029 0 51k
R36 N010 N018 20
R37 N018 N017 12k
C13 N018 N017 10µ
R38 N017 0 820
R39 N048 0 10
R40 24V N015 1k
C14 N015 0 22µ
R41 N036 N050 510k
R42 N050 N030 510k
R43 N036 N035 1k3
C15 N035 N034 33µ
C16 0 N034 10n
R44 N034 0 620
R45 N052 N030 {G}
C17 N053 N052 {C}
L1 N051 N053 {L}
C3 N033 N032 100µ
C1 N025 N024 4µ7
Q1 N014 N025 N041 0 NPN
Q2 N005 N014 N023 0 NPN
Q8 N011 N023 N032 0 NPN
Q9 N032 N016 N047 0 NPN
R1 N025 N049 6k2
C2 N014 N025 56p
R2 N032 N049 3k9
C5 N049 0 56µ
R3 N049 0 {TR1}
R4 N041 N046 100
R6 N046 0 2k
C7 N046 0 56µ
R7 N005 N014 68k
C9 N005 0 25µ
R9 24V N005 100
R10 N047 0 22
R11 N016 0 820
C18 N011 N016 4µ7
R13 N011 N016 20k
R14 24V N011 51
Q10 N001 N003 N006 0 NPN
Q11 N002 N006 N019 0 NPN
Q12 N019 N004 N028 0 NPN
R16 N028 0 30
R17 N004 0 820
C21 N002 N004 4µ7
R18 N002 N004 16k
R20 N001 N002 30
C19 N001 0 50µ
R46 24V N001 30
R15 N001 N003 10k
R47 N003 0 12k
C20 N003 N012 4µ7
C22 N040 N027 4µ7
XU1 0 N021 V+ V- N022 ADTL082  ; pins In+ In- V+ V- OUT
R48 N021 N040 10k
R49 N022 N021 10k
R50 siemens N022 100
R51 N077 N059 750
R52 N073 N077 2k5
R53 N079 N078 1
R54 N060 N080 750
C23 N067 N073 10n
R55 N057 N067 3k3
R56 N056 N059 1k3
R57 N058 N060 1k3
C24 N057 N056 470n
C25 N058 N057 470n
R58 N057 N056 5k
R59 N058 N057 5k
R60 N078 N073 1
C26 N078 0 150µ
XU2 0 N067 V+ V- N060 ADTL082  ; pins In+ In- V+ V- OUT
XU4 N068 N059 V+ V- N059 ADTL082  ; pins In+ In- V+ V- OUT
C27 N068 N012 2µ2
R61 N068 0 10k
R62 N069 N066 {VR1} tol=1 pwr=0.25
R63 N071 N069 {VR2} tol=1 pwr=0.25
R64 N070 N071 {G1}
C30 N070 N071 100p
C31 N066 0 100p
R67 N066 N055 {G1}
XU3 N066 N071 V+ V- N070 ADTL082  ; pins In+ In- V+ V- OUT
C32 N060 N067 220p
C33 N022 N021 22p
XU5 0 N064 V+ V- N065 ADTL082  ; pins In+ In- V+ V- OUT
R68 N064 N072 10k
R69 N065 N064 10k
R70 SIAM N065 100
R71 N080 N079 2k5
R72 N045 N044 2530
R73 0 N051 1
R76 N069 N074 {Q}
L2 N033 N034 6m
XU7 N061 N062 V+ V- N062 ADTL082  ; pins In+ In- V+ V- OUT
XU8 N063 N055 V+ V- N055 ADTL082  ; pins In+ In- V+ V- OUT
R74 N061 N060 3k
C35 N061 0 2n2
R75 N054 N062 3k3
R77 N063 N054 27k
C36 N063 0 220p
C37 N055 N054 2n2
C34 N065 N064 22p
C38 N072 N070 22µ
XU9 N075 N076 V+ V- N076 ADTL082  ; pins In+ In- V+ V- OUT
C39 N074 N075 {C1}
R78 N081 N075 1k
C40 N076 N081 {C2}
R79 N081 0 1k
R65 P001 NC_01 680
C28 P001 P002 {C}
L3 0 P002 {L}
.model NPN NPN
.model PNP PNP
.lib standard.bjt
;ac dec 100 10 24k
* Inductance
* 0,7 kHz = 235mH
* 1,0 kHz = 170mH
* 1.5 kHz = 110mH
* 2.3 kHz = 80mH
* 3.5 kHz = 53mH
* 5.6 kHz = 30mH
.param TR1=440 TR2a=1580 TR2b=3320 TR3=3840
* Capacitance
* 0,7 kHz = 220nF
* 1,0 kHz = 150nF
* 1.5 kHz = 100nF
* 2.3 kHz = 60nF
* 3.5 kHz = 39nF
* 5.6 kHz = 27nF
* Gain
* +2dB = 3k7
* +4dB = 1k6
* +6dB = 910
* +8dB = 580
* -2dB = 4k9
* -4dB = 2k1
* -6dB = 1k3
* -8dB = 850
;step param G list 3k7 1k6 910 570
;step param G list 4k9 2k1 1k3 830
* 1.1V
* DC offset
* DC Bias point
* Q-Mod
* 8db = 1
* 6db = 500R
* 4db = 1k5
* 2db = 4k7
* #Ideal Capacitances
* #0.7 kHz = 66n9 / 773n
* #1.0 kHz = 46n8 / 541n
* #1.5 kHz = 31n2 / 361n
* #2.3 kHz = 20n4 / 235n
* #3.5 kHz = 13n4 / 155n
* #5.6 kHz = 8n4 / 97n
.param G=580
.param C=27n L=30m C1=9n C2=90n
* Rounded Values
* 0,7 kHz = 133n / 3n3 / 118k
* 1,0 kHz = 100n / 2n2 / 115k
* 1.5 kHz = 68n / 1n5 / 110k
* 2.3 kHz = 43n / 1n / 111k
* 3.5 kHz = 25n / 680p / 120k
* 5.6 kHz = 15n / 470p / 115k
.param VR1=10k VR2=1
.param Q=1
.ac dec 101 200 20k
;noise V(SIAM) V3 oct 24 10 24k
.param G1=3000
.lib ADI.lib
.backanno
.end